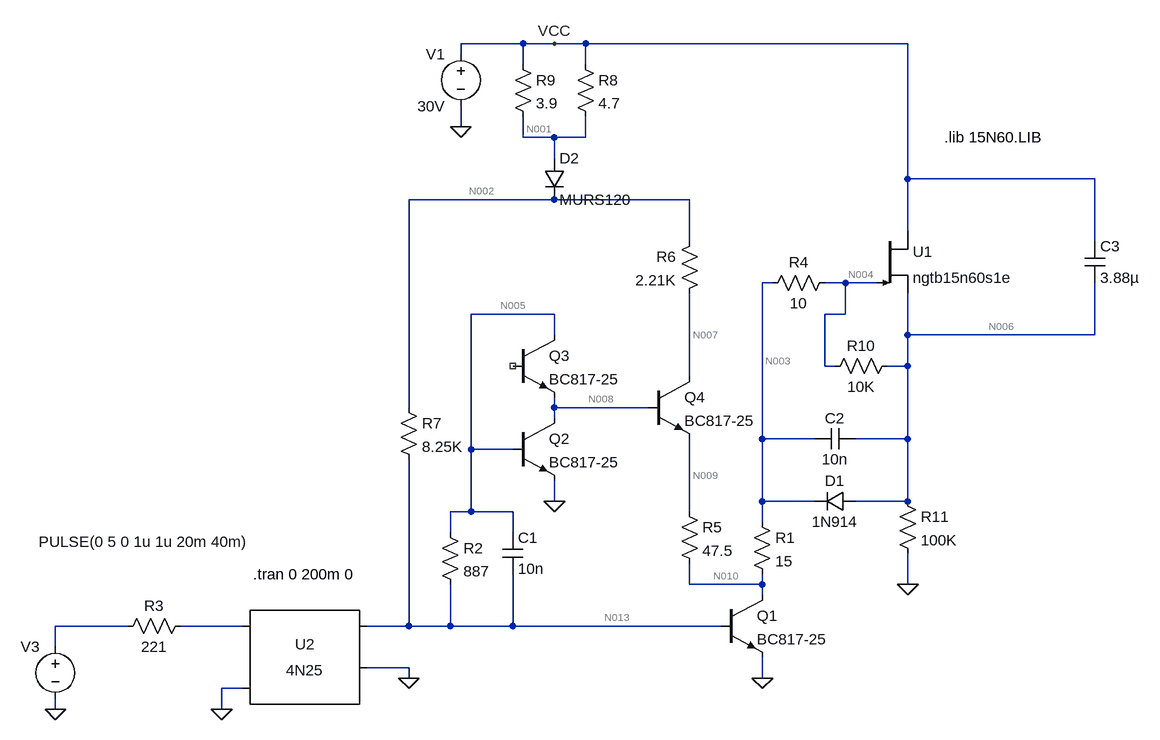
[diagram p0: schematic circuito disparo amostra.asc]
circuito disparo amostra.asc, the LTspice schematic file:
Version 4
SHEET 1 1452 680
WIRE 0 -832 -96 -832
WIRE 48 -832 0 -832
WIRE 96 -832 48 -832
WIRE 592 -832 96 -832
WIRE -96 -816 -96 -832
WIRE 0 -800 0 -832
WIRE 96 -800 96 -832
WIRE -96 -704 -96 -736
WIRE 0 -688 0 -720
WIRE 48 -688 0 -688
WIRE 96 -688 96 -720
WIRE 96 -688 48 -688
WIRE 48 -656 48 -688
WIRE 592 -624 592 -832
WIRE 880 -624 592 -624
WIRE 48 -592 -176 -592
WIRE 256 -592 48 -592
WIRE 592 -544 592 -624
WIRE 256 -528 256 -592
WIRE 880 -528 880 -624
WIRE 384 -464 368 -464
WIRE 496 -464 464 -464
WIRE 544 -464 496 -464
WIRE 48 -416 -80 -416
WIRE 496 -416 496 -464
WIRE 496 -416 464 -416
WIRE 48 -384 48 -416
WIRE 592 -384 592 -448
WIRE 880 -384 880 -464
WIRE 880 -384 592 -384
WIRE 464 -336 464 -416
WIRE 480 -336 464 -336
WIRE 592 -336 592 -384
WIRE 592 -336 560 -336
WIRE 256 -320 256 -448
WIRE -176 -272 -176 -592
WIRE 48 -272 48 -288
WIRE 192 -272 48 -272
WIRE 48 -256 48 -272
WIRE 368 -224 368 -464
WIRE 448 -224 368 -224
WIRE 592 -224 592 -336
WIRE 592 -224 512 -224
WIRE -80 -208 -80 -416
WIRE -16 -208 -80 -208
WIRE 48 -128 48 -160
WIRE 368 -128 368 -224
WIRE 448 -128 368 -128
WIRE 592 -128 592 -224
WIRE 592 -128 512 -128
WIRE -80 -112 -80 -208
WIRE -80 -112 -112 -112
WIRE -16 -112 -80 -112
WIRE 256 -112 256 -224
WIRE 368 -96 368 -128
WIRE -112 -80 -112 -112
WIRE -16 -80 -16 -112
WIRE 256 0 256 -32
WIRE 368 0 368 -16
WIRE 368 0 256 0
WIRE 592 0 592 -48
WIRE 368 16 368 0
WIRE -608 64 -720 64
WIRE -432 64 -528 64
WIRE -176 64 -176 -192
WIRE -176 64 -240 64
WIRE -112 64 -112 0
WIRE -112 64 -176 64
WIRE -16 64 -16 -16
WIRE -16 64 -112 64
WIRE 304 64 -16 64
WIRE -720 96 -720 64
WIRE -176 128 -240 128
WIRE -176 144 -176 128
WIRE 368 144 368 112
WIRE -432 160 -464 160
WIRE -720 192 -720 176
WIRE -464 192 -464 160
FLAG -176 144 0
FLAG -464 192 0
FLAG -720 192 0
FLAG 368 144 0
FLAG 48 -128 0
FLAG 48 -832 VCC
FLAG -96 -704 0
FLAG 592 0 0
SYMBOL Optos\\4N25 -336 128 R0
SYMATTR InstName U2
SYMBOL voltage -720 80 M0
WINDOW 123 0 0 Left 2
WINDOW 39 0 0 Left 2
WINDOW 3 -298 -146 Left 2
SYMATTR Value PULSE(0 5 0 1u 1u 20m 40m)
SYMATTR InstName V3
SYMBOL npn 304 16 R0
SYMATTR InstName Q1
SYMATTR Value BC817-25
SYMBOL res 352 -112 R0
SYMATTR InstName R1
SYMATTR Value 15
SYMATTR SpiceLine tol=1 pwr=0.1
SYMBOL res -128 -96 R0
SYMATTR InstName R2
SYMATTR Value 887
SYMATTR SpiceLine tol=1 pwr=0.1
SYMBOL cap -32 -80 R0
SYMATTR InstName C1
SYMATTR Value 10n
SYMATTR SpiceLine V=100 Irms=4.58 Rser=0.025 Lser=0 mfg="KEMET" pn="C2225C105K1RAC" type="X7R"
SYMBOL npn -16 -256 R0
SYMATTR InstName Q2
SYMATTR Value BC817-25
SYMBOL npn -16 -384 R0
SYMATTR InstName Q3
SYMATTR Value BC817-25
SYMBOL res 368 -448 R270
WINDOW 0 32 56 VTop 2
WINDOW 3 0 56 VBottom 2
SYMATTR InstName R4
SYMATTR Value 10
SYMATTR SpiceLine tol=1 pwr=0.1
SYMBOL Misc\\nigbt 544 -544 R0
SYMATTR InstName U1
SYMATTR Value ngtb15n60s1e
SYMBOL diode 512 -112 M270
WINDOW 0 32 32 VTop 2
WINDOW 3 0 32 VBottom 2
SYMATTR InstName D1
SYMATTR Value 1N914
SYMBOL cap 448 -208 R270
WINDOW 0 32 32 VTop 2
WINDOW 3 0 32 VBottom 2
SYMATTR InstName C2
SYMATTR Value 10n
SYMATTR SpiceLine V=100 Irms=4.58 Rser=0.025 Lser=0 mfg="KEMET" pn="C2225C105K1RAC" type="X7R"
SYMBOL npn 192 -320 R0
SYMATTR InstName Q4
SYMATTR Value BC817-25
SYMBOL res 240 -128 R0
SYMATTR InstName R5
SYMATTR Value 47.5
SYMATTR SpiceLine tol=1 pwr=0.1
SYMBOL res 272 -544 M0
SYMATTR InstName R6
SYMATTR Value 2.21K
SYMATTR SpiceLine tol=1 pwr=0.1
SYMBOL res -192 -288 R0
SYMATTR InstName R7
SYMATTR Value 8.25K
SYMATTR SpiceLine tol=1 pwr=0.1
SYMBOL diode 32 -656 R0
SYMATTR InstName D2
SYMATTR Value MURS120
SYMBOL res 80 -816 R0
SYMATTR InstName R8
SYMATTR Value 4.7
SYMATTR SpiceLine tol=1 pwr=0.1
SYMBOL res -16 -816 R0
SYMATTR InstName R9
SYMATTR Value 3.9
SYMATTR SpiceLine tol=1 pwr=0.1
SYMBOL cap 864 -528 R0
SYMATTR InstName C3
SYMATTR Value 3.88µ
SYMATTR SpiceLine V=25 Irms=0 Rser=0.005 Lser=0
SYMBOL voltage -96 -832 M0
WINDOW 123 0 0 Left 2
WINDOW 39 0 0 Left 2
SYMATTR InstName V1
SYMATTR Value 30V
SYMBOL res -512 48 R90
WINDOW 0 0 56 VBottom 2
WINDOW 3 32 56 VTop 2
SYMATTR InstName R3
SYMATTR Value 221
SYMATTR SpiceLine tol=1 pwr=0.1
SYMBOL res 576 -352 R90
WINDOW 0 0 56 VBottom 2
WINDOW 3 32 56 VTop 2
SYMATTR InstName R10
SYMATTR Value 10K
SYMATTR SpiceLine tol=1 pwr=0.1
SYMBOL res 576 -144 R0
SYMATTR InstName R11
SYMATTR Value 100K
SYMATTR SpiceLine tol=1 pwr=0.1
TEXT -416 -16 Left 2 !.tran 0 200m 0
TEXT 648 -688 Left 2 !.lib 15N60.LIB

The netlist it stands for:
* circuito disparo amostra.asc
XU2 N012 0 N013 0 NC_01 4N25
V3 N011 0 PULSE(0 5 0 1u 1u 20m 40m)
Q1 N010 N013 0 0 BC817-25
R1 N003 N010 15 tol=1 pwr=0.1
R2 N005 N013 887 tol=1 pwr=0.1
C1 N005 N013 10n V=100 Irms=4.58 Rser=0.025 Lser=0 mfg="KEMET" pn="C2225C105K1RAC" type="X7R"
Q2 N008 N005 0 0 BC817-25
Q3 N005 NC_02 N008 0 BC817-25
R4 N003 N004 10 tol=1 pwr=0.1
Z§U1 VCC N004 N006 ngtb15n60s1e
D1 N006 N003 1N914
C2 N003 N006 10n V=100 Irms=4.58 Rser=0.025 Lser=0 mfg="KEMET" pn="C2225C105K1RAC" type="X7R"
Q4 N007 N008 N009 0 BC817-25
R5 N009 N010 47.5 tol=1 pwr=0.1
R6 N002 N007 2.21K tol=1 pwr=0.1
R7 N002 N013 8.25K tol=1 pwr=0.1
D2 N001 N002 MURS120
R8 VCC N001 4.7 tol=1 pwr=0.1
R9 VCC N001 3.9 tol=1 pwr=0.1
C3 VCC N006 3.88µ V=25 Irms=0 Rser=0.005 Lser=0
V1 VCC 0 30V
R3 N012 N011 221 tol=1 pwr=0.1
R10 N006 N004 10K tol=1 pwr=0.1
R11 N006 0 100K tol=1 pwr=0.1
.model D D
.lib standard.dio
.model NPN NPN
.model PNP PNP
.lib standard.bjt
.tran 0 200m 0
.lib 15N60.LIB
.lib 4N25.sub
.backanno
.end

* Results of the author's LTspice run, read from the files saved beside the schematic
* Operating Point, zero values left out:
*   V(n013) = 716.3 mV
*   V(n010) = 2.997 mV
*   V(n003) = 3.028 mV
*   V(n005) = 621.2 mV
*   V(n008) = 1.858 mV
*   V(n004) = 3.049 mV
*   V(vcc) = 30 V
*   V(n006) = 23.74 mV
*   V(n007) = 29.48 V
*   V(n009) = 2.997 mV
*   V(n002) = 29.48 V
*   V(n001) = 29.99 V
*   Ic(Q4) = 29.59 pA
*   Ib(Q4) = -29.49 pA
*   Ic(Q3) = 83.81 pA
*   Ie(Q3) = -83.81 pA
*   Ic(Q2) = 113.3 pA
*   Ib(Q2) = 107.2 µA
*   Ie(Q2) = -107.2 µA
*   Ic(Q1) = 2.071 µA
*   Ib(Q1) = 3.379 mA
*   Ie(Q1) = -3.381 mA
*   I(D2) = 3.486 mA
*   I(D1) = 1.443 nA
*   I(R11) = 237.4 nA
*   I(R10) = 2.07 µA
*   I(R9) = 1.905 mA
*   I(R8) = 1.581 mA
*   I(R7) = 3.486 mA
*   I(R6) = 29.6 pA
*   I(R4) = -2.07 µA
*   I(R2) = -107.2 µA
*   I(R1) = 2.071 µA
*   I(V1) = -3.489 mA
*   Ix(u2:3) = 1.683 pA
*   Ix(u2:4) = -1.683 pA
*   Ix(u1:1) = 1.809 µA
*   Ix(u1:2) = -29.47 pA
*   Ix(u1:3) = -2.308 µA
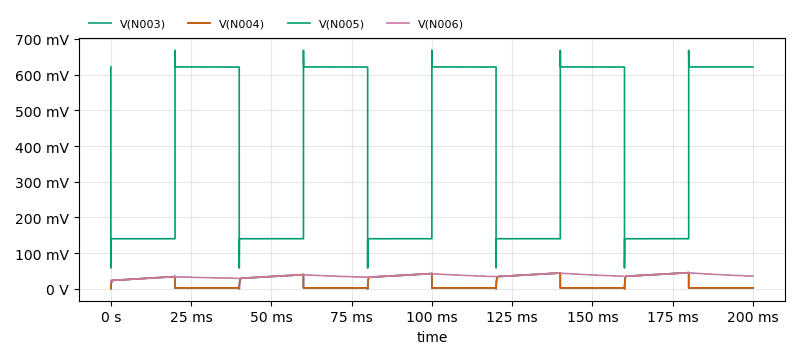
[diagram p1: Transient Analysis of circuito disparo amostra.asc, plotted from the saved traces]
* Transient Analysis, 1 run:
*   V(N003): min 427.7 µV, max 46.08 mV, average 19.54 mV, rms 25.86 mV, last 3.047 mV
*   V(N004): min 452.1 µV, max 46.08 mV, average 19.56 mV, rms 25.86 mV, last 3.08 mV
*   V(N005): min 58.63 mV, max 667.6 mV, average 380.9 mV, rms 450.4 mV, last 621.2 mV
*   V(N006): min 23.74 mV, max 45.14 mV, average 36.6 mV, rms 36.87 mV, last 35.83 mV